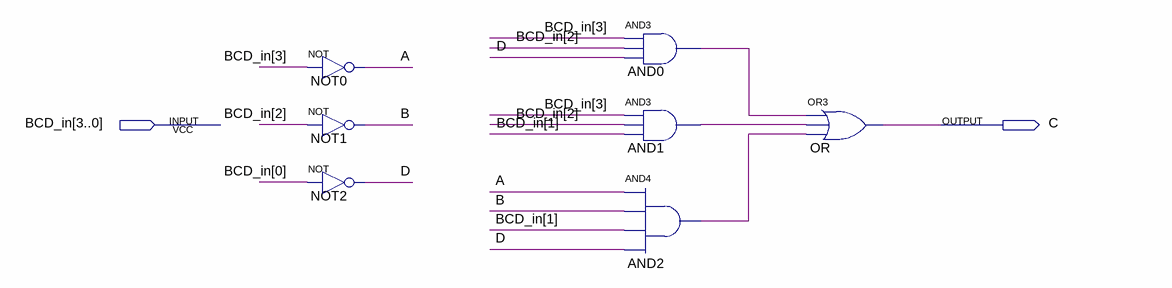
[diagram p0: schematic sheet]
// Quartus schematic DECOD_BCD_C.bdf as structural Verilog: 7 symbols, 2 pins
module DECOD_BCD_C (
  input  [3:0] BCD_in,
  output C
);

  wire A, AND0_out, AND1_out, AND2_out, B, D;

  not NOT0 (A, BCD_in[3]);
  not NOT1 (B, BCD_in[2]);
  not NOT2 (D, BCD_in[0]);
  and AND0 (AND0_out, BCD_in[3], BCD_in[2], D);
  and AND1 (AND1_out, BCD_in[3], BCD_in[2], BCD_in[1]);
  and AND2 (AND2_out, A, B, BCD_in[1], D);
  or OR (C, AND0_out, AND1_out, AND2_out);
endmodule
